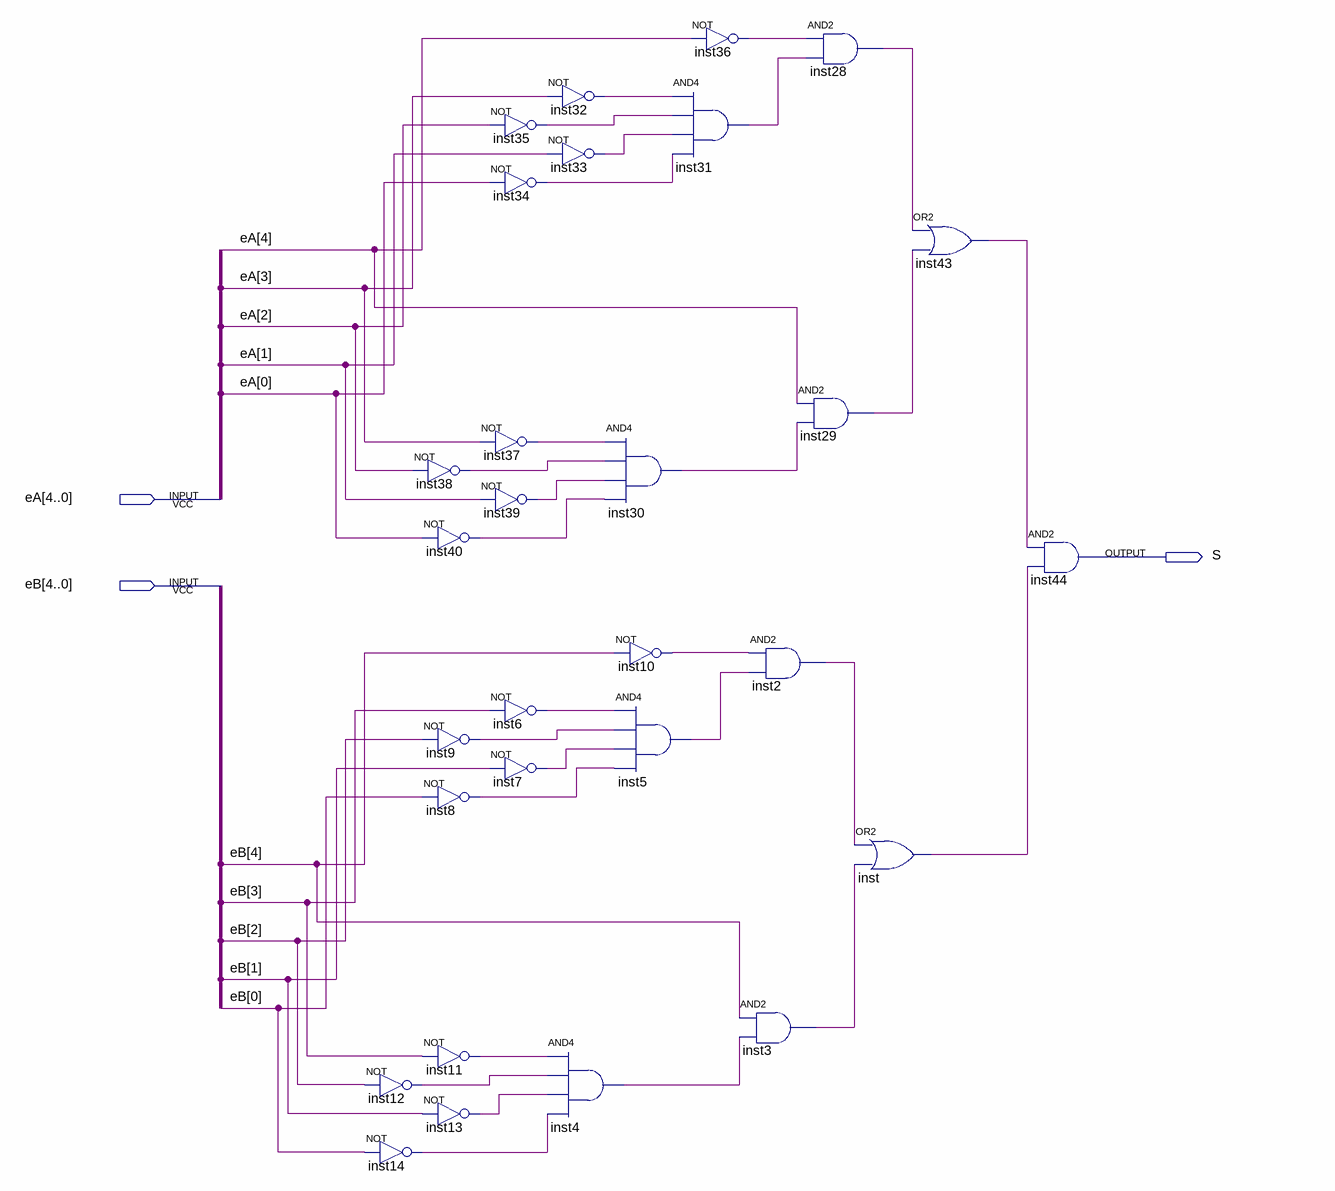
[diagram p0: schematic sheet]
// Quartus schematic casosejazero.bdf as structural Verilog: 29 symbols, 3 pins
module casosejazero (
  input  [4:0] eA,
  input  [4:0] eB,
  output S
);

  wire inst2_out, inst3_out, inst4_out, inst5_out, inst6_out, inst7_out, inst8_out, inst9_out, inst10_out,
       inst11_out, inst12_out, inst13_out, inst14_out, inst28_out, inst29_out, inst30_out, inst31_out,
       inst32_out, inst33_out, inst34_out, inst35_out, inst36_out, inst37_out, inst38_out, inst39_out,
       inst40_out, inst43_out, inst_out;

  not inst12 (inst12_out, eB[2]);
  not inst14 (inst14_out, eB[0]);
  not inst37 (inst37_out, eA[3]);
  not inst38 (inst38_out, eA[2]);
  not inst39 (inst39_out, eA[1]);
  not inst40 (inst40_out, eA[0]);
  not inst9 (inst9_out, eB[2]);
  not inst8 (inst8_out, eB[0]);
  not inst11 (inst11_out, eB[3]);
  not inst13 (inst13_out, eB[1]);
  not inst32 (inst32_out, eA[3]);
  not inst35 (inst35_out, eA[2]);
  not inst33 (inst33_out, eA[1]);
  not inst34 (inst34_out, eA[0]);
  not inst6 (inst6_out, eB[3]);
  not inst7 (inst7_out, eB[1]);
  and inst4 (inst4_out, inst11_out, inst12_out, inst13_out, inst14_out);
  and inst30 (inst30_out, inst37_out, inst38_out, inst39_out, inst40_out);
  not inst10 (inst10_out, eB[4]);
  and inst5 (inst5_out, inst6_out, inst9_out, inst7_out, inst8_out);
  not inst36 (inst36_out, eA[4]);
  and inst31 (inst31_out, inst32_out, inst35_out, inst33_out, inst34_out);
  and inst2 (inst2_out, inst10_out, inst5_out);
  and inst3 (inst3_out, eB[4], inst4_out);
  and inst28 (inst28_out, inst36_out, inst31_out);
  and inst29 (inst29_out, eA[4], inst30_out);
  or inst (inst_out, inst2_out, inst3_out);
  or inst43 (inst43_out, inst28_out, inst29_out);
  and inst44 (S, inst43_out, inst_out);
endmodule
